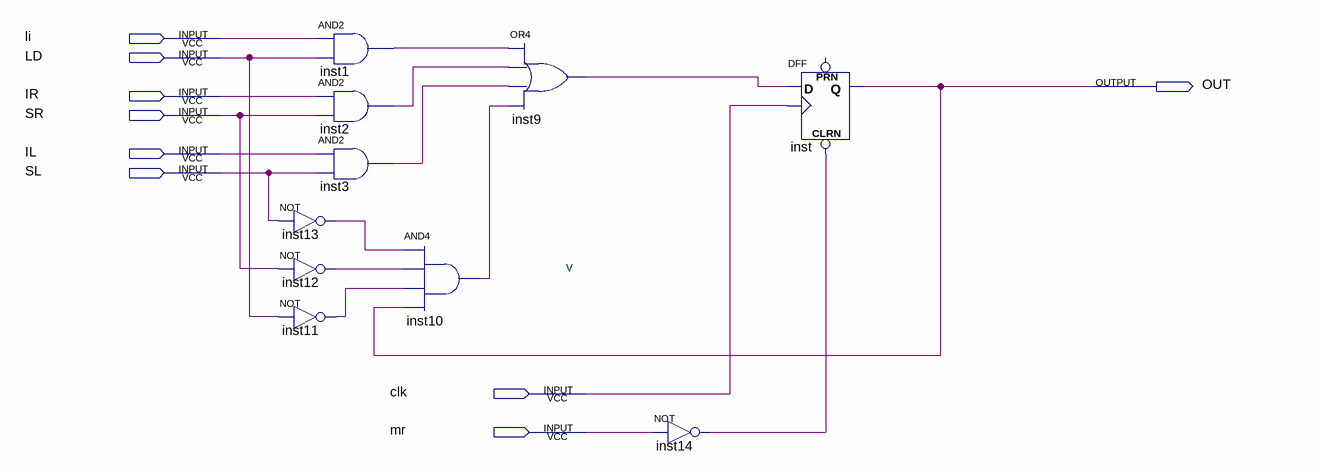
[diagram p0: schematic sheet]
// Quartus schematic REG1.bdf as structural Verilog: 10 symbols, 9 pins
module REG1 (
  input  li,
  input  LD,
  input  IR,
  input  SR,
  input  IL,
  input  SL,
  input  clk,
  input  mr,
  output OUT
);

  wire inst1_out, inst2_out, inst3_out, inst9_out, inst10_out, inst11_out, inst12_out, inst13_out, inst14_out;

  and inst1 (inst1_out, li, LD);
  and inst2 (inst2_out, IR, SR);
  and inst3 (inst3_out, IL, SL);
  not inst13 (inst13_out, SL);
  not inst12 (inst12_out, SR);
  not inst11 (inst11_out, LD);
  and inst10 (inst10_out, inst13_out, inst12_out, inst11_out, OUT);
  or inst9 (inst9_out, inst1_out, inst2_out, inst3_out, inst10_out);
  not inst14 (inst14_out, mr);
  DFF inst (.CLRN(inst14_out), .CLK(clk), .D(inst9_out), .Q(OUT));  // open: PRN

  // Notes on the sheet:
  //   v
endmodule
